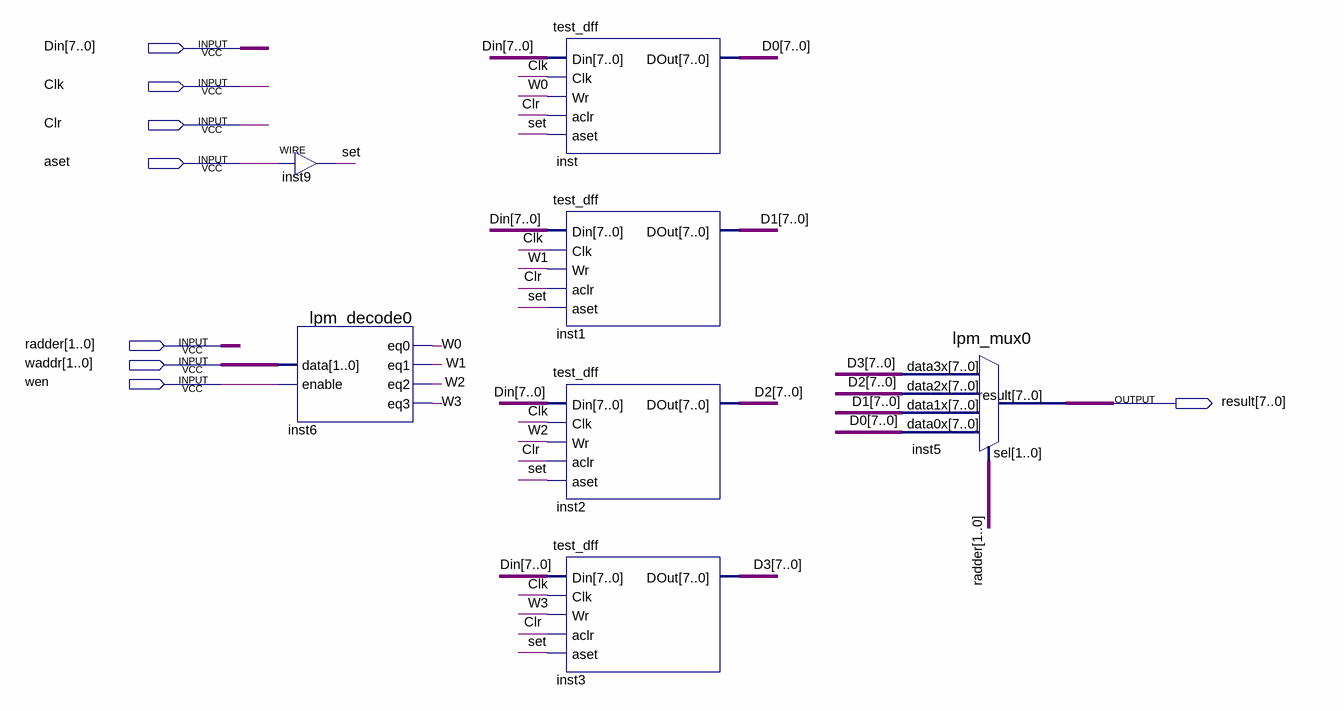
[diagram p0: schematic sheet]
// Quartus schematic GPRs.bdf as structural Verilog: 7 symbols, 8 pins
module GPRs (
  input  [7:0] Din,
  input  Clk,
  input  Clr,
  input  aset,
  input  [1:0] radder,
  input  [1:0] waddr,
  input  wen,
  output [7:0] result
);

  wire set, W0, W1, W2, W3;
  wire [7:0] D0, D1, D2, D3;

  assign set = aset;  // WIRE inst9
  lpm_decode0 inst6 (.data(waddr), .enable(wen), .eq0(W0), .eq1(W1), .eq2(W2), .eq3(W3));
  test_dff inst (.Din(Din), .Clk(Clk), .Wr(W0), .aclr(Clr), .aset(set), .DOut(D0));
  test_dff inst1 (.Din(Din), .Clk(Clk), .Wr(W1), .aclr(Clr), .aset(set), .DOut(D1));
  test_dff inst2 (.Din(Din), .Clk(Clk), .Wr(W2), .aclr(Clr), .aset(set), .DOut(D2));
  test_dff inst3 (.Din(Din), .Clk(Clk), .Wr(W3), .aclr(Clr), .aset(set), .DOut(D3));
  lpm_mux0 inst5 (.data3x(D3), .data2x(D2), .data1x(D1), .data0x(D0), .sel(radder), .result(result));
endmodule
